# EAGLE schematic analog-fan-controller (EAGLE 7.7.0)
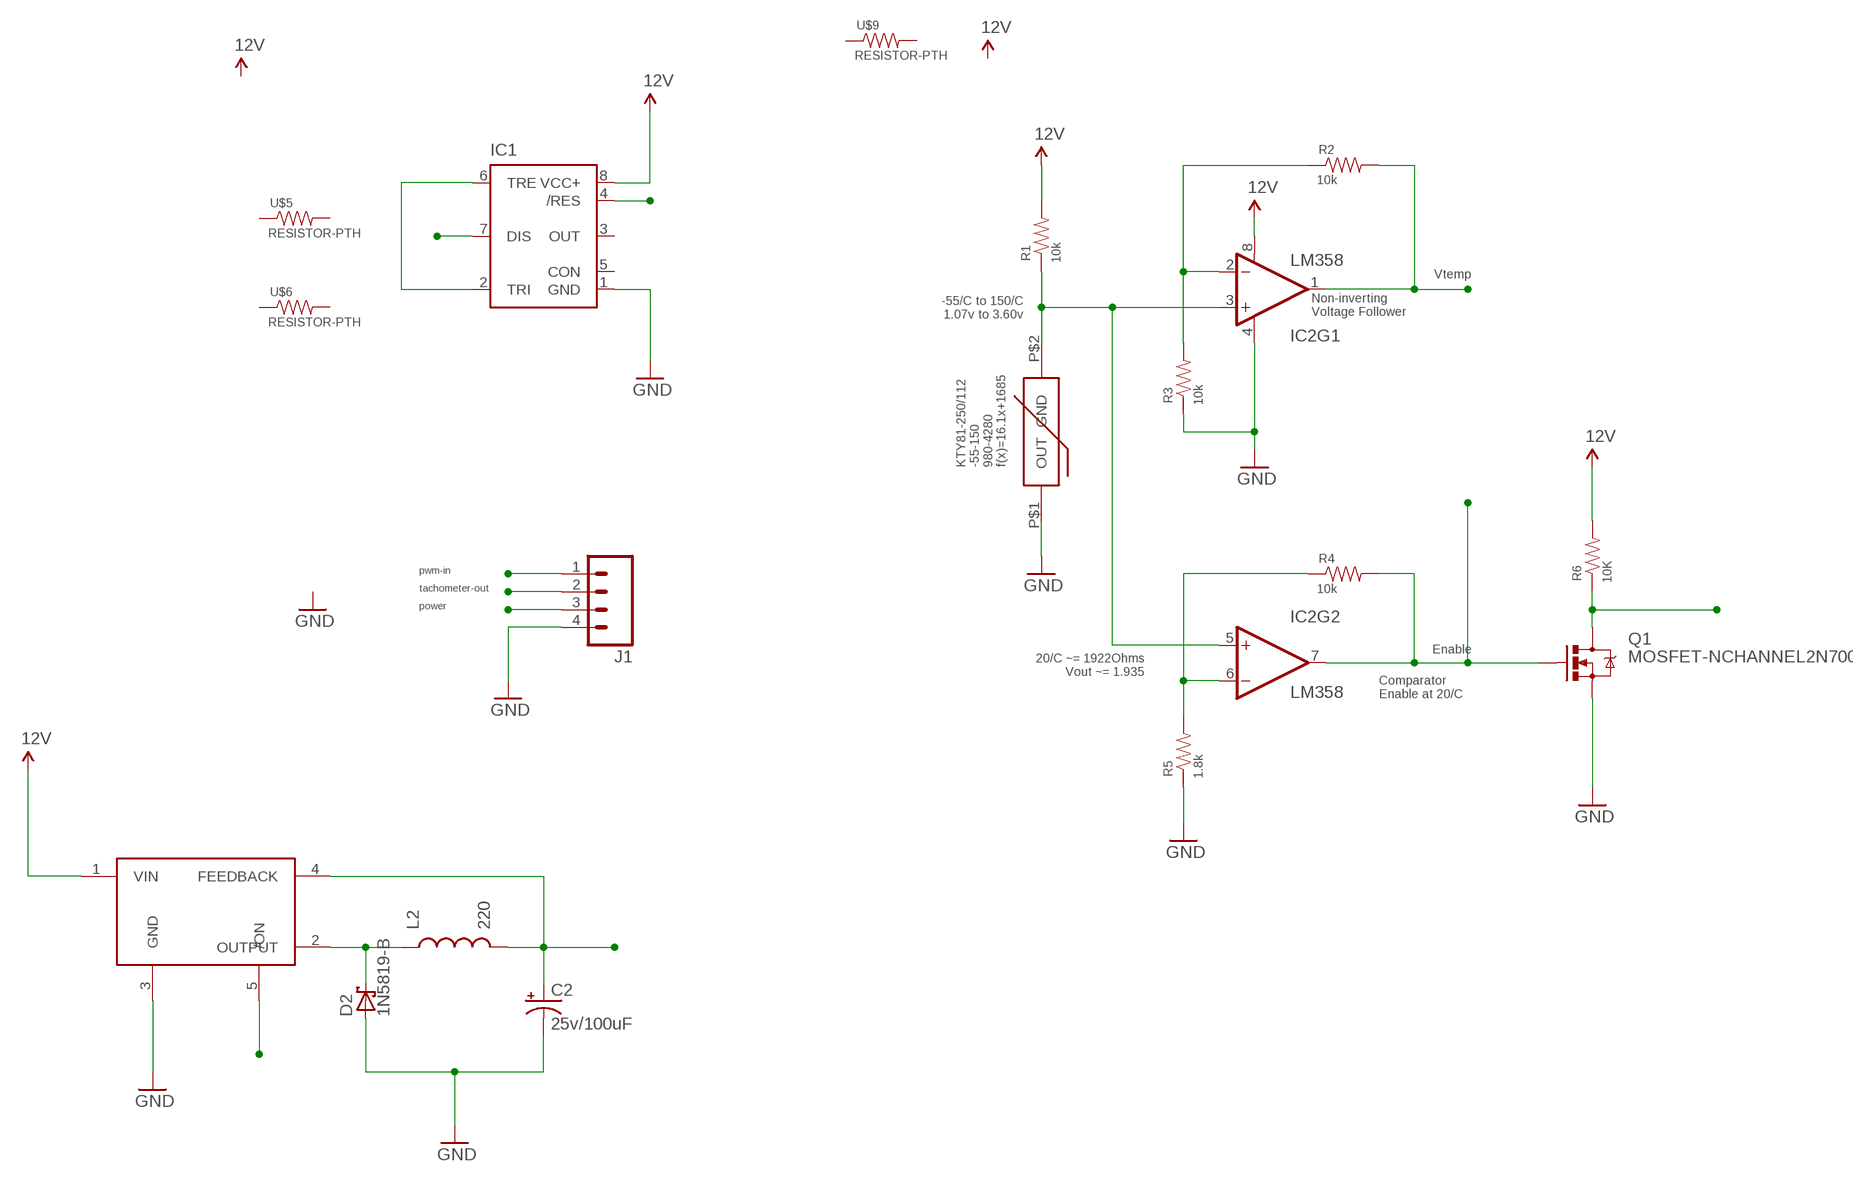
[diagram p0: schematic, sheet 1]

## Parts
C2  25v/100uF  1000UF-25V(PTH)  [CPOL-RADIAL-1000UF-25V]
D2  1N5819-B  [DO41-7.6]
IC1  NE555P  [DIL-08]
IC2  LM358  [DIP08]
J1  M04POLAR  [MOLEX-1X4]
L2  220  INDUCTORAXIAL-0.6  [AXIAL-0.6]
Q1  MOSFET-NCHANNEL2N7000  [TO-92]
R1  10k  RESISTOR-PTH  [VERT-PTH]
R2  10k  RESISTOR-PTH  [VERT-PTH]
R3  10k  RESISTOR-PTH  [VERT-PTH]
R4  10k  RESISTOR-PTH  [VERT-PTH]
R5  1.8k  RESISTOR-PTH  [VERT-PTH]
R6  10K  RESISTOR-PTH  [VERT-PTH]
RT  980  KTY81  [TO-92-2]
U$2  LM2576XXVERTICAL  [TO-220-5]
U$5  RESISTOR-PTH  [VERT-PTH]
U$6  RESISTOR-PTH  [VERT-PTH]
U$9  RESISTOR-PTH  [VERT-PTH]

## Nets
12V: IC1.8(VCC+) IC2.8(V+) R1.2(G$2) R6.2(G$2) U$2.1(VIN)
DC-PWM: IC1.7(DIS)
ENABLE: IC1.4(/RES) IC2.7(OUT) Q1.2(G) R4.2(G$2)
FAN-POWER: C2.+ J1.3 L2.P$2 U$2.4(FEEDBACK)
GND: C2.- D2.A IC1.1(GND) IC2.4(V-) J1.4 Q1.1(S) R3.1(G$1) R5.1(G$1) RT.P$1(OUT) U$2.3(GND)
N$1: IC2.2(-IN) R2.1(G$1) R3.2(G$2)
N$2: IC1.2(TRI) IC1.6(TRE)
N$3: D2.C L2.P$1 U$2.2(OUTPUT)
N$4: IC2.6(-IN) R4.1(G$1) R5.2(G$2)
N$5: J1.2
N$6: J1.1
POWER-ENABLE: Q1.3(D) R6.1(G$1) U$2.5(/ON)
VOUTT: IC2.3(+IN) IC2.5(+IN) R1.1(G$1) RT.P$2(GND)
VTEMP: IC2.1(OUT) R2.2(G$2)
Unconnected: IC1.3(OUT) IC1.5(CON) U$5.1(G$1) U$5.2(G$2) U$6.1(G$1) U$6.2(G$2) U$9.1(G$1) U$9.2(G$2)

## Notes on the sheet
- Vtemp
- -55/C to 150/C
  1.07v to 3.60v
- Non-inverting
  Voltage Follower
- KTY81-250/112
  -55-150
  980-4280
  f(x)=16.1x+1685
- pwm-in
- tachometer-out
- power
- 20/C ~= 1922Ohms
  Vout ~= 1.935
- Enable
- Comparator
  Enable at 20/C

## Library data of the parts
C2 = SparkFun-Capacitors:1000UF-25V(PTH): CAP-08070; PROD_ID: CAP-09538; VALUE: CAP-09538
D2 = diode:1N581*: 1.0A SCHOTTKY BARRIER RECTIFIER Source: http://www.diodes.com/datasheets/ds23001.pdf
IC1 = SparkFun-AnalogIC:NE555: General purpose bipolar Timer; MF: Arrow Electronics; MPN: NE555N; OC_FARNELL: 1467742; OC_NEWARK: 89K1486
IC2 = SparkFun-AnalogIC:LM358: Jellybean op-amp; PROD_ID: IC-09172
J1 = SparkFun-Connectors:M04: Header 4 Standard 4-pin 0.1" header. Use with straight break away headers (SKU : PRT-00116), right angle break away headers (PRT-00553), swiss pins (PRT-00743), machine pins (PRT-00117), and female headers (PRT-00115). Molex polarized connector foot print use with SKU : PRT-08231 with associated crimp pins and housings. 1MM SMD Version SKU: PRT-10208
L2 = SparkFun-Passives:INDUCTOR: Inductors Basic Inductor/Choke - 0603 and 1206. Footprints are not proven and vary greatly between part numbers. INDUCTOR POWER 3.3UH 4.0A SMD 0.197" L x 0.197" W x 0.177" H (5.00mm x 5.00mm x 4.50mm)
Q1 = SparkFun-DiscreteSemi:MOSFET-NCHANNEL: Common NMOSFET Parts MFG P/N Store ID Prod ID FDD8780 TRANS-09984 SI7820DN TRANS-11055 FDS6630A IC-08089 2N7002PW TRANS-11151 FQP30N06L COM-10213 TRANS-10060 BSS123LT1G TRANS-08345 BSS138 TRANS-00830 BS170 2N7000
R1-R6 U$5 U$6 U$9 = Synapseware:RESISTOR-PTH
RT = Synapseware:KTY81: Silicon temperature sensors The temperature sensors in the KTY81 series have a positive temperature coefficient of resistance and are suitable for use in measurement and control systems. The sensors are encapsulated in the SOD70 2 in-line leads plastic package.
U$2 = Synapseware:LM2576XX: LM2576xx Series SIMPLE SWITCHER ® 3-A Step-Down Voltage Regulator